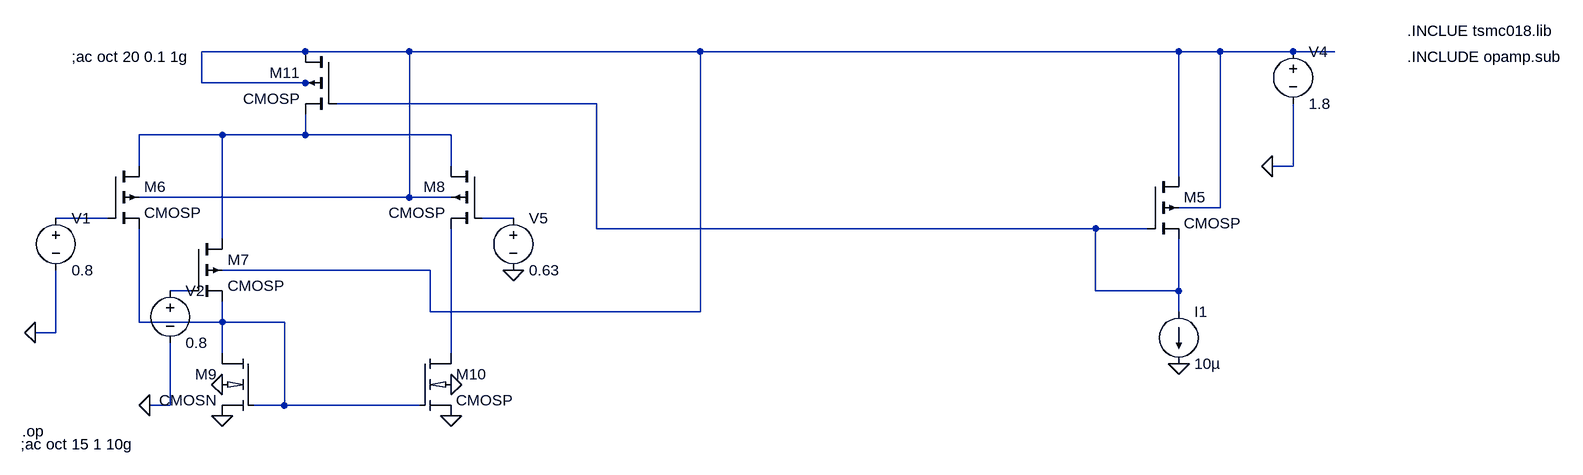
[diagram p0: schematic cmfb1.asc]
cmfb1.asc, the LTspice schematic file:
Version 4
SHEET 1 1436 1284
WIRE -528 -544 -688 -544
WIRE -368 -544 -528 -544
WIRE 80 -544 -368 -544
WIRE 816 -544 80 -544
WIRE 880 -544 816 -544
WIRE 992 -544 880 -544
WIRE 1056 -544 992 -544
WIRE -688 -496 -688 -544
WIRE -528 -496 -688 -496
WIRE -512 -496 -528 -496
WIRE -80 -464 -480 -464
WIRE -656 -416 -784 -416
WIRE -528 -416 -528 -448
WIRE -528 -416 -656 -416
WIRE -304 -416 -528 -416
WIRE -784 -368 -784 -416
WIRE -304 -368 -304 -416
WIRE 992 -368 992 -464
WIRE 992 -368 960 -368
WIRE 816 -352 816 -544
WIRE -368 -320 -368 -544
WIRE -368 -320 -784 -320
WIRE -304 -320 -368 -320
WIRE 880 -304 880 -544
WIRE 880 -304 816 -304
WIRE -832 -288 -912 -288
WIRE -208 -288 -256 -288
WIRE -80 -272 -80 -464
WIRE 688 -272 -80 -272
WIRE 768 -272 688 -272
WIRE -656 -256 -656 -416
WIRE -336 -208 -656 -208
WIRE -704 -176 -736 -176
WIRE 688 -176 688 -272
WIRE 816 -176 816 -256
WIRE 816 -176 688 -176
WIRE -336 -144 -336 -208
WIRE 80 -144 80 -544
WIRE 80 -144 -336 -144
WIRE 816 -144 816 -176
WIRE -784 -128 -784 -272
WIRE -656 -128 -656 -160
WIRE -656 -128 -784 -128
WIRE -560 -128 -656 -128
WIRE -912 -112 -912 -208
WIRE -912 -112 -944 -112
WIRE -656 -80 -656 -128
WIRE -304 -80 -304 -272
WIRE -736 0 -736 -96
WIRE -736 0 -768 0
WIRE -560 0 -560 -128
WIRE -560 0 -608 0
WIRE -352 0 -560 0
FLAG 816 -64 0
FLAG 960 -368 0
FLAG -304 16 0
FLAG -656 16 0
FLAG -208 -208 0
FLAG -944 -112 0
FLAG -768 0 0
FLAG -656 -32 0
FLAG -304 -32 0
SYMBOL cmosp 768 -352 R0
SYMATTR InstName M5
SYMATTR Value2 l=0.24u w=6.4u
SYMBOL current 816 -144 R0
WINDOW 123 0 0 Left 0
WINDOW 39 0 0 Left 0
SYMATTR InstName I1
SYMATTR Value 10µ
SYMBOL voltage 992 -560 R0
WINDOW 123 0 0 Left 0
WINDOW 39 0 0 Left 0
SYMATTR InstName V4
SYMATTR Value 1.8
SYMBOL cmosp -832 -368 R0
SYMATTR InstName M6
SYMATTR Value2 l=0.24u w=3.2u
SYMBOL cmosp -704 -256 R0
SYMATTR InstName M7
SYMATTR Value2 l=0.24u w=3.2u
SYMBOL cmosp -256 -368 M0
SYMATTR InstName M8
SYMATTR Value2 l=0.24u w=6.4u
SYMBOL cmosn -608 -80 M0
SYMATTR InstName M9
SYMBOL cmosn -352 -80 R0
SYMATTR InstName M10
SYMATTR Value CMOSP
SYMATTR Value2 l=0.24u w=0.4u
SYMBOL cmosp -480 -544 M0
SYMATTR InstName M11
SYMATTR Value2 l=0.24u w=12.8u
SYMBOL voltage -208 -304 R0
WINDOW 123 0 0 Left 0
WINDOW 39 0 0 Left 0
SYMATTR InstName V5
SYMATTR Value 0.63
SYMBOL voltage -912 -304 R0
WINDOW 123 0 0 Left 0
WINDOW 39 0 0 Left 0
SYMATTR InstName V1
SYMATTR Value 0.8
SYMBOL voltage -736 -192 R0
WINDOW 123 0 0 Left 0
WINDOW 39 0 0 Left 0
SYMATTR InstName V2
SYMATTR Value 0.8
TEXT 1168 -576 Left 0 !.INCLUE tsmc018.lib
TEXT 1168 -536 Left 0 !.INCLUDE opamp.sub
TEXT -964 40 Left 0 !.op
TEXT -888 -536 Left 0 !;ac oct 20 0.1 1g
TEXT -966 60 Left 0 !;ac oct 15 1 10g

The netlist it stands for:
* cmfb1.asc
M5 N001 N002 N002 N001 CMOSP l=0.24u w=6.4u
I1 N002 0 10µ
V4 N001 0 1.8
M6 N003 N004 N007 N001 CMOSP l=0.24u w=3.2u
M7 N003 N006 N007 N001 CMOSP l=0.24u w=3.2u
M8 N003 N005 N008 N001 CMOSP l=0.24u w=6.4u
M9 N007 N007 0 0 CMOSN
M10 N008 N007 0 0 CMOSP l=0.24u w=0.4u
M11 N001 N002 N003 N001 CMOSP l=0.24u w=12.8u
V5 N005 0 0.63
V1 N004 0 0.8
V2 N006 0 0.8
.model NMOS NMOS
.model PMOS PMOS
.lib standard.mos
.INCLUE tsmc018.lib
.INCLUDE opamp.sub
.op
;ac oct 20 0.1 1g
;ac oct 15 1 10g
.lib tsmc018.lib
.backanno
.end